# Altium schematic sheet stlink烧录转接板.SchDoc
size A4
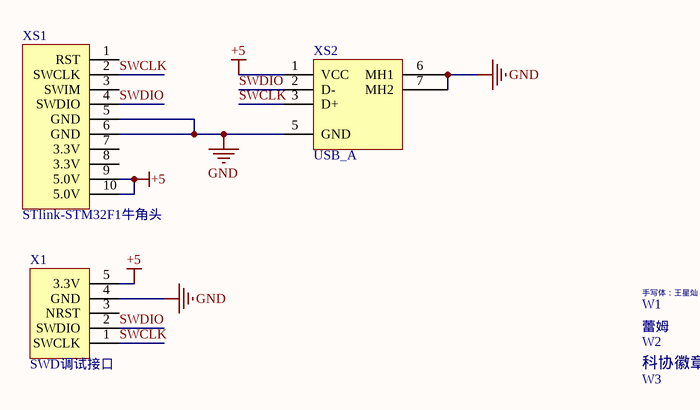
[diagram p0: stlink烧录转接板.SchDoc]

## Parts
W1  手写体：王星灿  [手写体：王星灿]  (value not drawn)
W2  蕾姆  [蕾姆360-340mil]  (value not drawn)
W3  科协徽章  [科协徽章2（310-310）]  (value not drawn)
X1  SWD调试接口  [SWD调试接口]
XS1  STlink-STM32F1牛角头  [STlink-STM32F1牛角头]
XS2  USB_A  [USB_A母口180度贴片]

## Nets
+5: X1.5(3.3V) XS1.9(5.0V) XS1.10(5.0V) XS2.1(VCC)
GND: X1.4(GND) XS1.5(GND) XS1.6(GND) XS2.5(GND) XS2.6(MH1) XS2.7(MH2)
SWCLK: X1.1(SWCLK) XS1.2(SWCLK) XS2.3(D+)
SWDIO: X1.2(SWDIO) XS1.4(SWDIO) XS2.2(D-)

Not connected (* = marked no-connect by the designer): X1 3(NRST); XS1 1(RST) 3(SWIM) 7(3.3V) 8(3.3V)

## Library data of the parts
XS2 = USB_A母座